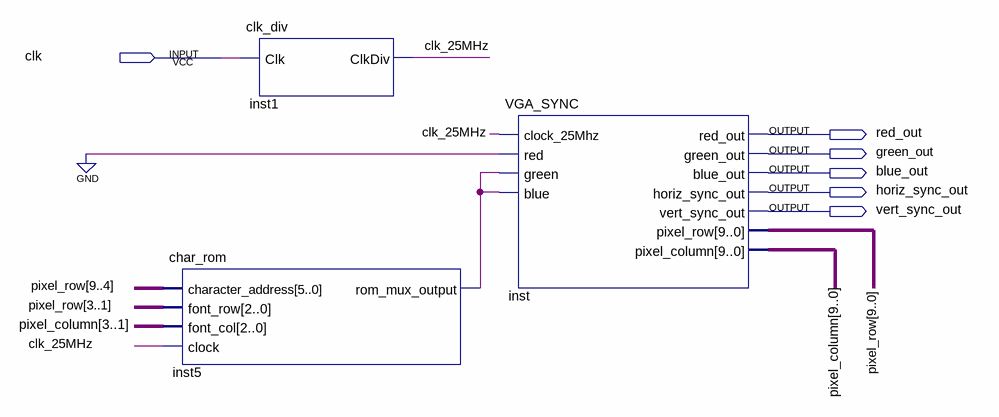
[diagram p0: schematic sheet]
// Quartus schematic Text testing.bdf as structural Verilog: 3 symbols, 6 pins
module \Text_testing  (
  input  clk,
  output red_out,
  output green_out,
  output blue_out,
  output horiz_sync_out,
  output vert_sync_out
);

  wire clk_25MHz, inst5_rom_mux_output;
  wire [9:0] pixel_column, pixel_row;

  char_rom inst5 (
    .character_address(pixel_row[9:4]), .font_row(pixel_row[3:1]), .font_col(pixel_column[3:1]),
    .clock(clk_25MHz), .rom_mux_output(inst5_rom_mux_output));
  clk_div inst1 (.Clk(clk), .ClkDiv(clk_25MHz));
  VGA_SYNC inst (
    .clock_25Mhz(clk_25MHz), .red(1'b0), .green(inst5_rom_mux_output), .blue(inst5_rom_mux_output),
    .red_out(red_out), .green_out(green_out), .blue_out(blue_out), .horiz_sync_out(horiz_sync_out),
    .vert_sync_out(vert_sync_out), .pixel_row(pixel_row), .pixel_column(pixel_column));
endmodule
